# EAGLE design hbridge_3.0 (EAGLE 7.7.0)
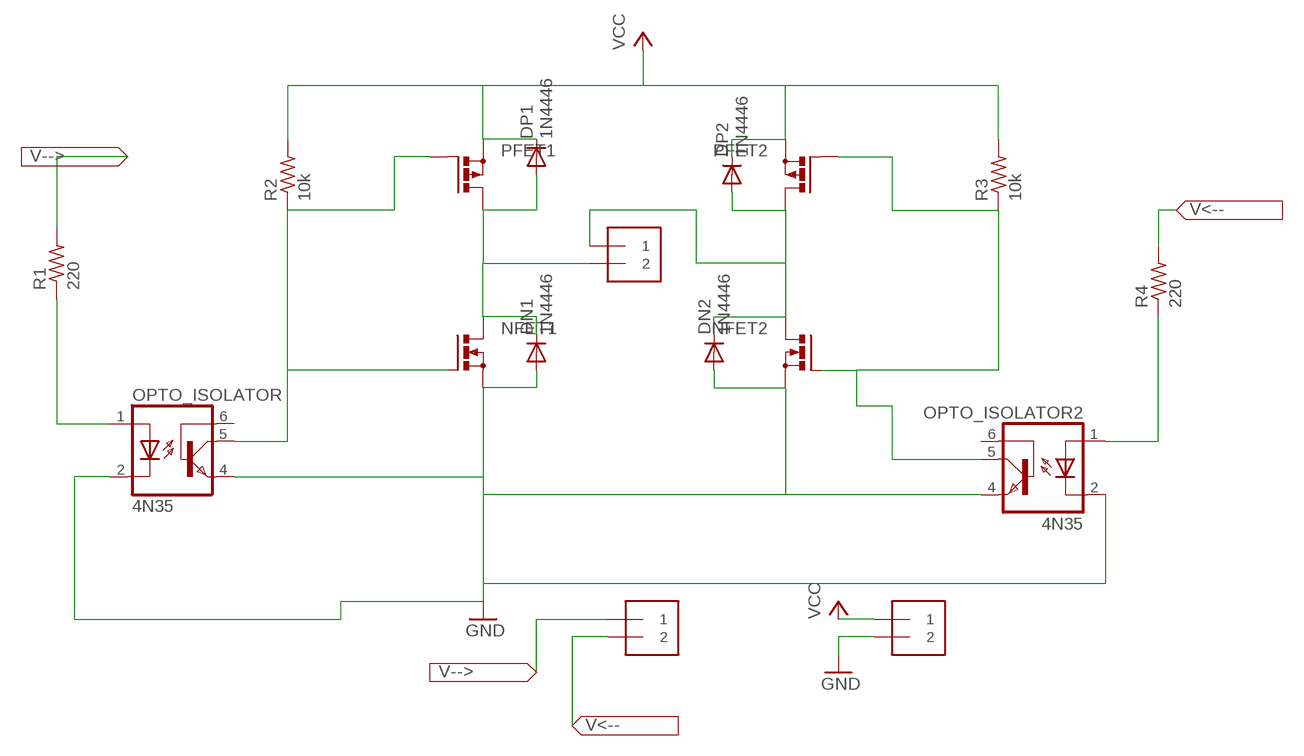
[diagram p0: schematic, sheet 1]

## Parts
ARDUINO  1X2-3.5MM  [1X2-3.5MM]
DN1  1N4446  [DO35-10]
DN2  1N4446  [DO35-10]
DP1  1N4446  [DO35-10]
DP2  1N4446  [DO35-10]
MOTOR  1X2-3.5MM  [1X2-3.5MM]
NFET1  PMOSFET_NTO220BH  [TO220BH]
NFET2  PMOSFET_NTO220BH  [TO220BH]
OPTO_ISOLATOR  4N35  [DIL06]
OPTO_ISOLATOR2  4N35  [DIL06]
PFET1  PMOSFET_PTO220BH  [TO220BH]
PFET2  PMOSFET_PTO220BH  [TO220BH]
POWER  1X2-3.5MM  [1X2-3.5MM]
R1  220  R-US_0207/15  [0207/15]
R2  10k  R-US_0207/15  [0207/15]
R3  10k  R-US_0207/15  [0207/15]
R4  220  R-US_0207/15  [0207/15]

## Nets
ARDUINO_A: ARDUINO.1 R1.2
ARDUINO_B: ARDUINO.2 R4.2
GND: DN1.A DN2.A NFET1.S NFET2.S OPTO_ISOLATOR2.2(C) OPTO_ISOLATOR2.4(EMI) OPTO_ISOLATOR.2(C) OPTO_ISOLATOR.4(EMI) POWER.2
MOTOR1: DN2.C DP2.A MOTOR.1 NFET2.D PFET2.D
MOTOR2: DN1.C DP1.A MOTOR.2 NFET1.D PFET1.D
N$1: OPTO_ISOLATOR.1(A) R1.1
N$4: OPTO_ISOLATOR2.1(A) R4.1
OPTO1: NFET1.G OPTO_ISOLATOR.5(COL) PFET1.G R2.1
OPTO2: NFET2.G OPTO_ISOLATOR2.5(COL) PFET2.G R3.1
VCC: DP1.C DP2.C PFET1.S PFET2.S POWER.1 R2.2 R3.2
Unconnected: OPTO_ISOLATOR2.6(BAS) OPTO_ISOLATOR.6(BAS)

## Library data of the parts
ARDUINO MOTOR POWER = adafruit:1X2: 3.5mm Terminal block http://www.ladyada.net/library/pcb/eaglelibrary.html
DN1 DN2 DP1 DP2 = diode:1N4446: DIODE high speed (Philips)
NFET1 NFET2 = transistor-power:PMOSFET_N: Power MOSFET N-Channel
OPTO_ISOLATOR OPTO_ISOLATOR2 = optocoupler:4N35: MOTOROLA OPTO COUPLER; MF: FAIRCHILD SEMICONDUCTOR; MPN: 4N35; OC_FARNELL: 1328375; OC_NEWARK: 72K9946
PFET1 PFET2 = transistor-power:PMOSFET_P: Power MOSFET P-Channel
R1-R4 = adafruit:R-US_: RESISTOR, American symbol

## Board
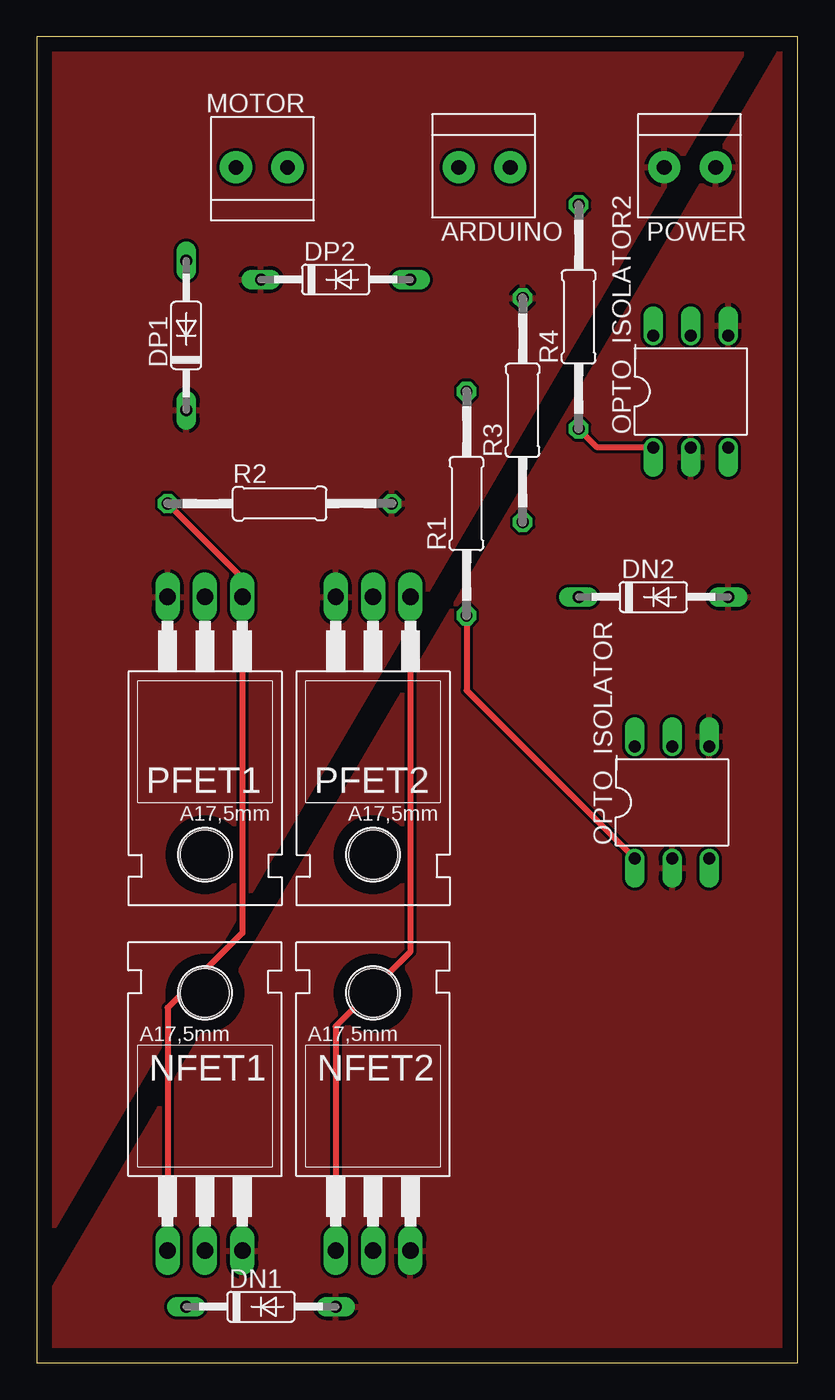
[diagram p1: board, top side]
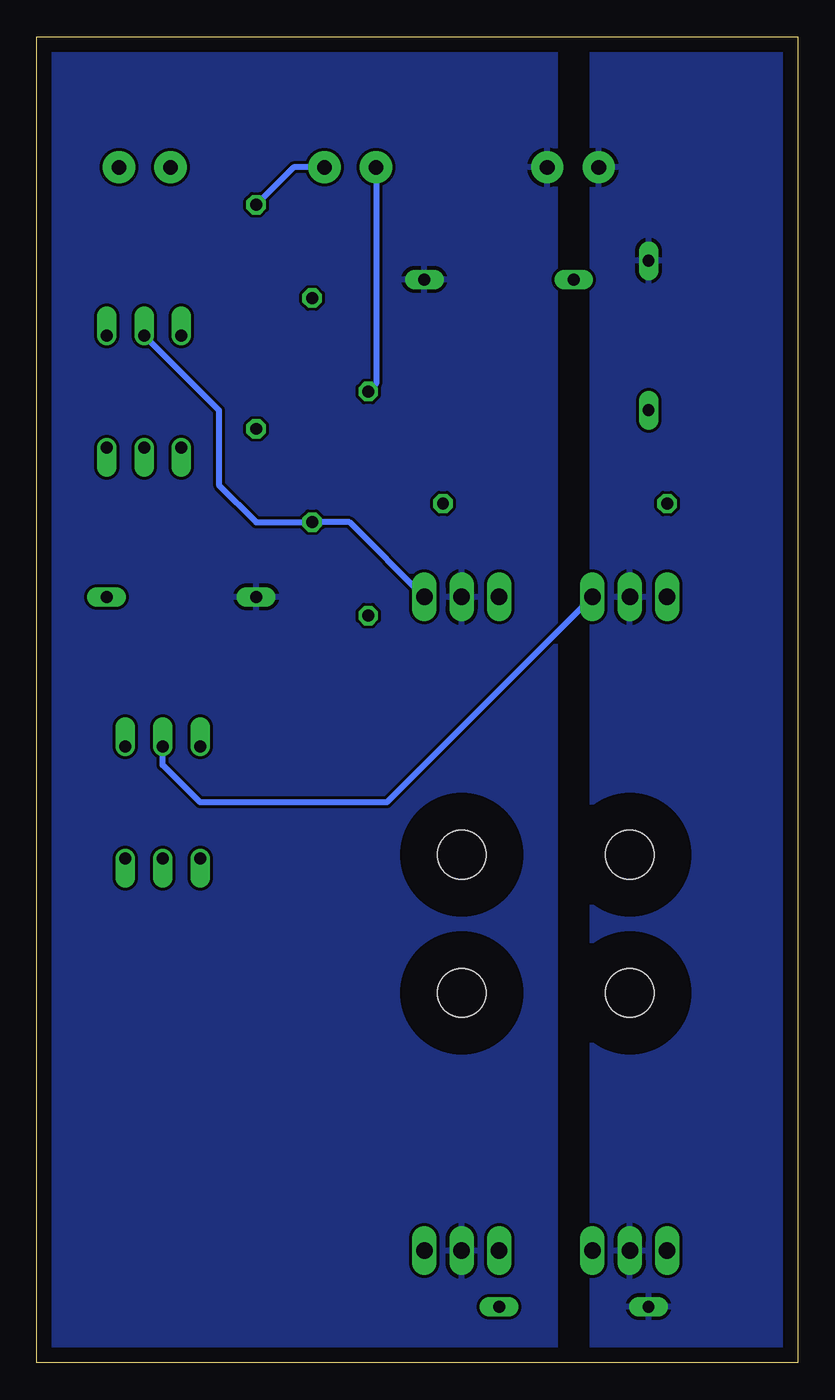
[diagram p2: board, bottom side, seen from below]

Size 51.74 x 90.16 mm. Coordinates in mm from the lower left corner, seen from the top.
Outline: 0,0 51.74,0 51.74,90.16 0,90.16 0,0
Copper layers (1*16): Top 0.035mm / dielectric 1.5mm / Bottom 0.035mm
Design rules "default": minimum track width 10mil, minimum drill 24mil, track to track 8mil, track to pad 8mil, pad to pad 8mil, via to via 8mil, smd to smd 8mil, copper to edge 40mil, drill to drill 8mil, minimum pad ring 10mil, minimum via ring 8mil, stop-mask expansion 4mil, vias tented up to drill 0mil, thermal gap 10mil

### Footprints (pad centres in the part's own frame; a part is rotated, then mirrored left to right if it is on the bottom)
1X2-3.5MM = drill 1 pad 2.184: 1 1.8,0; 2 -1.7,0
DO35-10 = drill 0.813 long: A 5.08,0; C -5.08,0
TO220BH = drill 1.118 long: D 0,-6.35; G -2.54,-6.35; S 2.54,-6.35 | hole 3.302: 0,11.176
DIL06 = drill 0.813 offset: 1 -2.54,-3.81; 2 0,-3.81; 3 2.54,-3.81; 4 2.54,3.81; 5 0,3.81; 6 -2.54,3.81
0207/15 = drill 0.813 octagon: 1 -7.62,0; 2 7.62,0

### Placement (x,y rotation side)
ARDUINO  30.48,81.28 180 top
DN1  15.24,3.81 0 top
DN2  41.91,52.07 0 top
DP1  10.16,69.85 90 top
DP2  20.32,73.66 0 top
MOTOR  15.24,81.28 0 top
NFET1  11.43,13.97 0 top
NFET2  22.86,13.97 0 top
OPTO_ISOLATOR  43.18,38.1 0 top
OPTO_ISOLATOR2  44.45,66.04 0 top
PFET1  11.43,45.72 180 top
PFET2  22.86,45.72 180 top
POWER  44.45,81.28 180 top
R1  29.21,58.42 90 top
R2  16.51,58.42 0 top
R3  33.02,64.77 90 top
R4  36.83,71.12 90 top

### Tracks (layer width: path | path; a pad name or v marks a point on that pad's centre or on a via)
ARDUINO_A
  Bottom 0.406: ARDUINO.1 28.68,66.57 R1.2
ARDUINO_B
  Bottom 0.406: ARDUINO.2 34.29,81.28 R4.2
GND
  pour Top: 53.34,93.98 72.39,93.98 72.39,-1.27 -2.54,-1.27
MOTOR1
  pour Bottom: 16.51,97.79 73.66,97.79 73.66,-2.54 16.51,-2.54
MOTOR2
  pour Bottom: -33.02,97.79 13.97,97.79 13.97,-2.54 -31.75,-2.54
N$1
  Top 0.406: R1.1 29.21,45.72 OPTO_ISOLATOR.1
N$4
  Top 0.406: OPTO_ISOLATOR2.1 38.1,62.23 R4.1
OPTO1
  Top 0.406: NFET1.G 8.89,24.13 13.97,29.21 PFET1.G 13.97,53.34 R2.1
  Bottom 0.406: PFET1.G 27.94,38.1 40.64,38.1 43.18,40.64 OPTO_ISOLATOR.5
OPTO2
  Top 0.406: PFET2.G 25.4,27.94 20.32,22.86 NFET2.G
  Bottom 0.406: PFET2.G 30.48,57.15 R3.1 36.83,57.15 39.37,59.69 39.37,64.77 OPTO_ISOLATOR2.5
VCC
  pour Top: -30.48,93.98 50.8,93.98 -5.08,-1.27 -30.48,-1.27